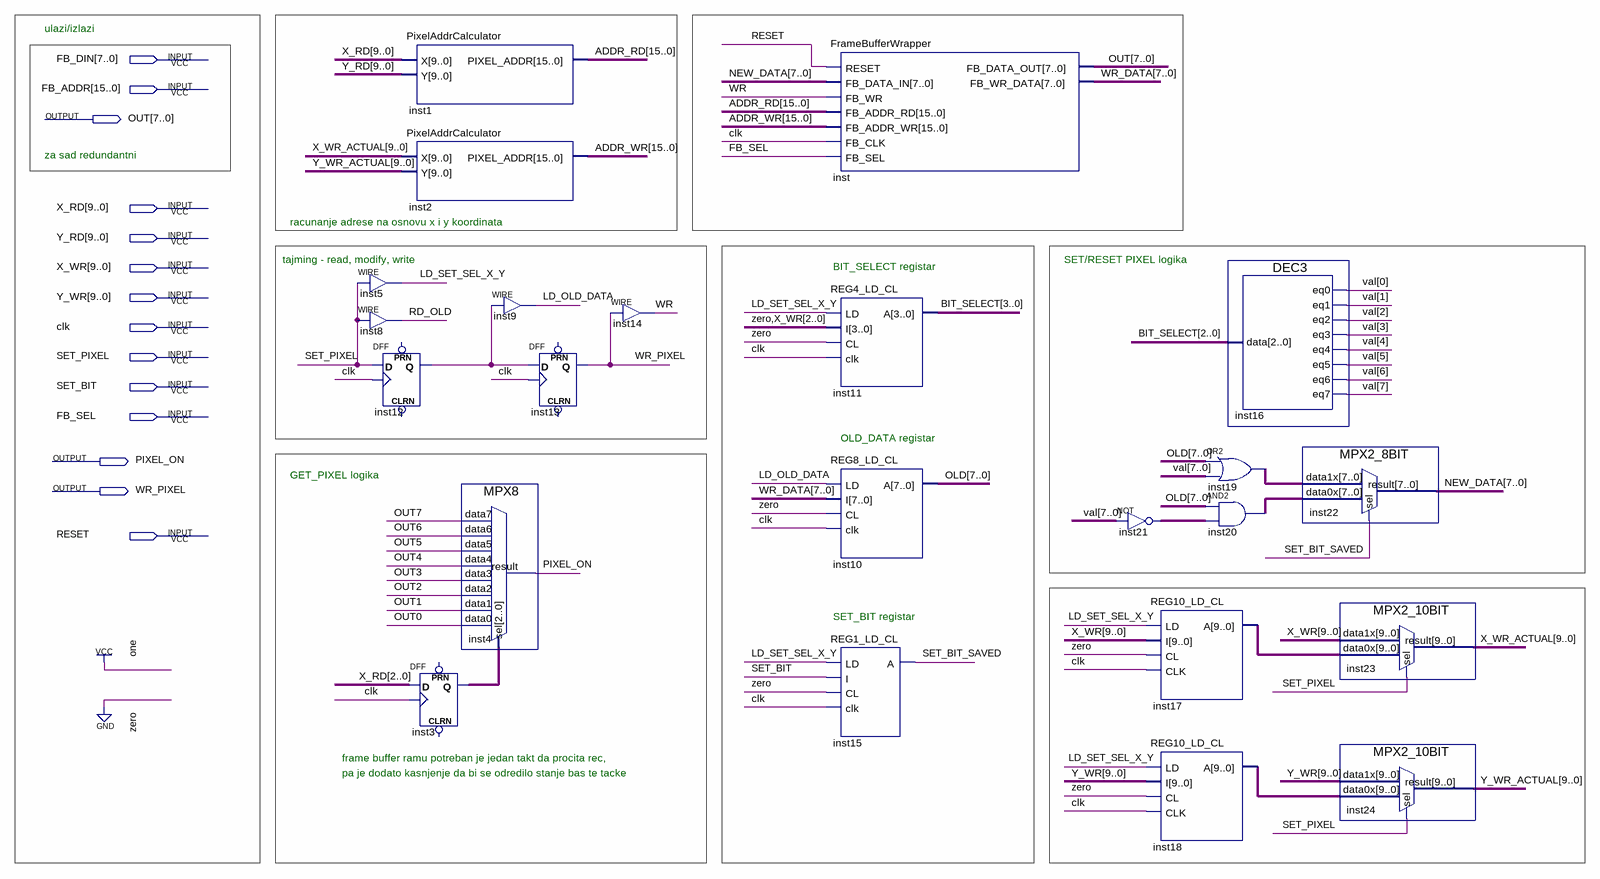
[diagram p0: schematic sheet]
// Quartus schematic FrameBuffer.bdf as structural Verilog: 23 symbols, 14 pins
module FrameBuffer (
  input  [7:0] FB_DIN,
  input  [15:0] FB_ADDR,
  input  [9:0] X_RD,
  input  [9:0] Y_RD,
  input  [9:0] X_WR,
  input  [9:0] Y_WR,
  input  clk,
  input  SET_PIXEL,
  input  SET_BIT,
  input  FB_SEL,
  input  RESET,
  output [7:0] OUT,
  output PIXEL_ON,
  output WR_PIXEL
);

  wire inst12_q, LD_OLD_DATA, LD_SET_SEL_X_Y, RD_OLD, SET_BIT_SAVED, WR;
  wire [2:0] inst3_q;
  wire [3:0] BIT_SELECT;
  wire [7:0] inst19_out, inst20_out, inst21_out, NEW_DATA, OLD, val, WR_DATA;
  wire [9:0] inst17_a, inst18_a, X_WR_ACTUAL, Y_WR_ACTUAL;
  wire [15:0] ADDR_RD, ADDR_WR;

  assign LD_SET_SEL_X_Y = SET_PIXEL;  // WIRE inst5
  assign RD_OLD = SET_PIXEL;  // WIRE inst8
  PixelAddrCalculator inst1 (.X(X_RD), .Y(Y_RD), .PIXEL_ADDR(ADDR_RD));
  PixelAddrCalculator inst2 (.X(X_WR_ACTUAL), .Y(Y_WR_ACTUAL), .PIXEL_ADDR(ADDR_WR));
  DFF inst12 (.CLK(clk), .D(SET_PIXEL), .Q(inst12_q));  // open: CLRN, PRN
  DFF inst3[2:0] (.CLK(clk), .D(X_RD[2:0]), .Q(inst3_q));  // open: CLRN, PRN
  MPX8 inst4 (
    .data7(OUT[7]), .data6(OUT[6]), .data5(OUT[5]), .data4(OUT[4]), .data3(OUT[3]), .data2(OUT[2]),
    .data1(OUT[1]), .data0(OUT[0]), .sel(inst3_q), .result(PIXEL_ON));
  assign LD_OLD_DATA = inst12_q;  // WIRE inst9
  DFF inst13 (.CLK(clk), .D(inst12_q), .Q(WR_PIXEL));  // open: CLRN, PRN
  assign WR = WR_PIXEL;  // WIRE inst14
  FrameBufferWrapper inst (
    .RESET(RESET), .FB_DATA_IN(NEW_DATA), .FB_WR(WR), .FB_ADDR_RD(ADDR_RD), .FB_ADDR_WR(ADDR_WR),
    .FB_CLK(clk), .FB_SEL(FB_SEL), .FB_DATA_OUT(OUT), .FB_WR_DATA(WR_DATA));
  REG4_LD_CL inst11 (.LD(LD_SET_SEL_X_Y), .I({1'b0, X_WR[2:0]}), .CL(1'b0), .clk(clk), .A(BIT_SELECT));
  REG8_LD_CL inst10 (.LD(LD_OLD_DATA), .I(WR_DATA), .CL(1'b0), .clk(clk), .A(OLD));
  REG1_LD_CL inst15 (.LD(LD_SET_SEL_X_Y), .I(SET_BIT), .CL(1'b0), .clk(clk), .A(SET_BIT_SAVED));
  assign inst21_out = ~val;  // NOT inst21, 8 bits wide
  REG10_LD_CL inst17 (.LD(LD_SET_SEL_X_Y), .I(X_WR), .CL(1'b0), .CLK(clk), .A(inst17_a));
  REG10_LD_CL inst18 (.LD(LD_SET_SEL_X_Y), .I(Y_WR), .CL(1'b0), .CLK(clk), .A(inst18_a));
  DEC3 inst16 (
    .data(BIT_SELECT[2:0]), .eq0(val[0]), .eq1(val[1]), .eq2(val[2]), .eq3(val[3]), .eq4(val[4]),
    .eq5(val[5]), .eq6(val[6]), .eq7(val[7]));
  assign inst19_out = OLD | val;  // OR2 inst19, 8 bits wide
  assign inst20_out = OLD & inst21_out;  // AND2 inst20, 8 bits wide
  MPX2_8BIT inst22 (.data1x(inst19_out), .data0x(inst20_out), .sel(SET_BIT_SAVED), .result(NEW_DATA));
  MPX2_10BIT inst23 (.data1x(X_WR), .data0x(inst17_a), .sel(SET_PIXEL), .result(X_WR_ACTUAL));
  MPX2_10BIT inst24 (.data1x(Y_WR), .data0x(inst18_a), .sel(SET_PIXEL), .result(Y_WR_ACTUAL));

  // Notes on the sheet:
  //   ulazi/izlazi
  //   za sad redundantni
  //   racunanje adrese na osnovu x i y koordinata
  //   tajming - read, modify, write
  //   SET/RESET PIXEL logika
  //   BIT_SELECT registar
  //   OLD_DATA registar
  //   GET_PIXEL logika
  //   SET_BIT registar
  //   frame buffer ramu potreban je jedan takt da procita rec,
  //   pa je dodato kasnjenje da bi se odredilo stanje bas te tacke
endmodule
